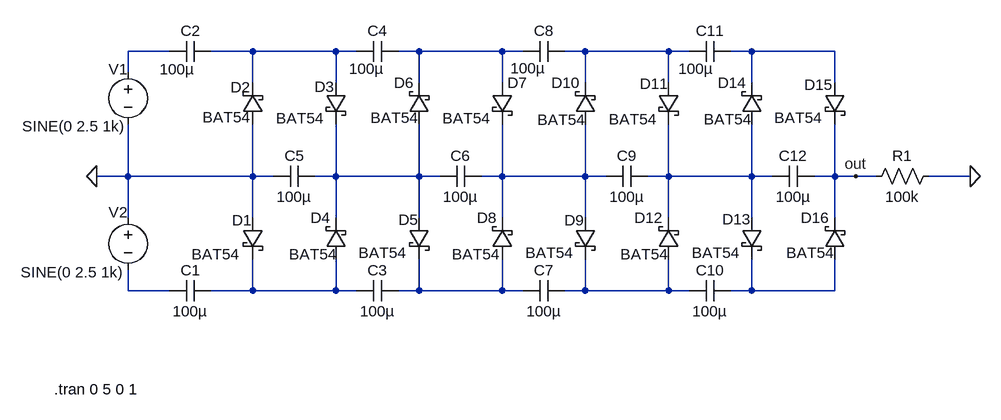
[diagram p0: schematic Draft1.asc]
Draft1.asc, the LTspice schematic file:
Version 4
SHEET 1 1124 680
WIRE -304 -608 -368 -608
WIRE -176 -608 -240 -608
WIRE -48 -608 -176 -608
WIRE -16 -608 -48 -608
WIRE 80 -608 48 -608
WIRE 208 -608 80 -608
WIRE 240 -608 208 -608
WIRE 336 -608 304 -608
WIRE 464 -608 336 -608
WIRE 496 -608 464 -608
WIRE 592 -608 560 -608
WIRE 720 -608 592 -608
WIRE -368 -576 -368 -608
WIRE -176 -560 -176 -608
WIRE -48 -560 -48 -608
WIRE 80 -560 80 -608
WIRE 208 -560 208 -608
WIRE 336 -560 336 -608
WIRE 464 -560 464 -608
WIRE 592 -560 592 -608
WIRE 720 -560 720 -608
WIRE -368 -416 -368 -496
WIRE -368 -416 -416 -416
WIRE -176 -416 -176 -496
WIRE -176 -416 -368 -416
WIRE -144 -416 -176 -416
WIRE -48 -416 -48 -496
WIRE -48 -416 -80 -416
WIRE 80 -416 80 -496
WIRE 80 -416 -48 -416
WIRE 112 -416 80 -416
WIRE 208 -416 208 -496
WIRE 208 -416 176 -416
WIRE 336 -416 336 -496
WIRE 336 -416 208 -416
WIRE 368 -416 336 -416
WIRE 464 -416 464 -496
WIRE 464 -416 432 -416
WIRE 592 -416 592 -496
WIRE 592 -416 464 -416
WIRE 624 -416 592 -416
WIRE 720 -416 720 -496
WIRE 720 -416 688 -416
WIRE 752 -416 720 -416
WIRE 784 -416 752 -416
WIRE 928 -416 864 -416
WIRE -368 -352 -368 -416
WIRE -176 -352 -176 -416
WIRE -48 -352 -48 -416
WIRE 80 -352 80 -416
WIRE 208 -352 208 -416
WIRE 336 -352 336 -416
WIRE 464 -352 464 -416
WIRE 592 -352 592 -416
WIRE 720 -352 720 -416
WIRE -368 -240 -368 -272
WIRE -304 -240 -368 -240
WIRE -176 -240 -176 -288
WIRE -176 -240 -240 -240
WIRE -48 -240 -48 -288
WIRE -48 -240 -176 -240
WIRE -16 -240 -48 -240
WIRE 80 -240 80 -288
WIRE 80 -240 48 -240
WIRE 208 -240 208 -288
WIRE 208 -240 80 -240
WIRE 240 -240 208 -240
WIRE 336 -240 336 -288
WIRE 336 -240 304 -240
WIRE 464 -240 464 -288
WIRE 464 -240 336 -240
WIRE 496 -240 464 -240
WIRE 592 -240 592 -288
WIRE 592 -240 560 -240
WIRE 720 -240 720 -288
WIRE 720 -240 592 -240
FLAG -416 -416 0
FLAG 752 -416 out
FLAG 928 -416 0
SYMBOL voltage -368 -592 R0
WINDOW 0 -15 -4 Top 2
WINDOW 3 -84 115 Bottom 2
WINDOW 123 0 0 Left 0
WINDOW 39 0 0 Left 0
SYMATTR InstName V1
SYMATTR Value SINE(0 2.5 1k)
SYMBOL voltage -368 -368 R0
WINDOW 0 -15 23 Bottom 2
WINDOW 3 -86 84 Top 2
WINDOW 123 0 0 Left 0
WINDOW 39 0 0 Left 0
SYMATTR InstName V2
SYMATTR Value SINE(0 2.5 1k)
SYMBOL cap -240 -256 R90
WINDOW 0 0 32 VBottom 2
WINDOW 3 32 32 VTop 2
SYMATTR InstName C1
SYMATTR Value 100µ
SYMBOL cap -240 -624 R90
WINDOW 0 0 32 VBottom 2
WINDOW 3 28 52 VTop 2
SYMATTR InstName C2
SYMATTR Value 100µ
SYMBOL schottky -192 -352 R0
WINDOW 3 -78 56 Left 2
WINDOW 0 -16 4 Left 2
SYMATTR Value BAT54
SYMATTR InstName D1
SYMATTR Description Diode
SYMATTR Type diode
SYMBOL schottky -160 -496 R180
WINDOW 0 19 57 Left 2
WINDOW 3 20 11 Left 2
SYMATTR InstName D2
SYMATTR Value BAT54
SYMATTR Description Diode
SYMATTR Type diode
SYMBOL schottky -64 -560 R0
WINDOW 3 -76 55 Left 2
WINDOW 0 -17 6 Left 2
SYMATTR Value BAT54
SYMATTR InstName D3
SYMATTR Description Diode
SYMATTR Type diode
SYMBOL schottky -32 -288 R180
WINDOW 0 24 64 Left 2
WINDOW 3 15 8 Left 2
SYMATTR InstName D4
SYMATTR Value BAT54
SYMATTR Description Diode
SYMATTR Type diode
SYMBOL cap -80 -432 R90
WINDOW 0 0 32 VBottom 2
WINDOW 3 32 32 VTop 2
SYMATTR InstName C5
SYMATTR Value 100µ
SYMBOL cap 48 -256 R90
WINDOW 0 0 32 VBottom 2
WINDOW 3 32 32 VTop 2
SYMATTR InstName C3
SYMATTR Value 100µ
SYMBOL cap 48 -624 R90
WINDOW 0 0 32 VBottom 2
WINDOW 3 27 49 VTop 2
SYMATTR InstName C4
SYMATTR Value 100µ
SYMBOL schottky 64 -352 R0
WINDOW 3 -77 54 Left 2
WINDOW 0 -16 3 Left 2
SYMATTR Value BAT54
SYMATTR InstName D5
SYMATTR Description Diode
SYMATTR Type diode
SYMBOL schottky 96 -496 R180
WINDOW 0 24 64 Left 2
WINDOW 3 17 10 Left 2
SYMATTR InstName D6
SYMATTR Value BAT54
SYMATTR Description Diode
SYMATTR Type diode
SYMBOL schottky 192 -560 R0
WINDOW 3 -76 55 Left 2
SYMATTR Value BAT54
SYMATTR InstName D7
SYMATTR Description Diode
SYMATTR Type diode
SYMBOL schottky 224 -288 R180
WINDOW 0 24 64 Left 2
WINDOW 3 20 8 Left 2
SYMATTR InstName D8
SYMATTR Value BAT54
SYMATTR Description Diode
SYMATTR Type diode
SYMBOL cap 176 -432 R90
WINDOW 0 0 32 VBottom 2
WINDOW 3 32 32 VTop 2
SYMATTR InstName C6
SYMATTR Value 100µ
SYMBOL cap 304 -256 R90
WINDOW 0 0 32 VBottom 2
WINDOW 3 32 32 VTop 2
SYMATTR InstName C7
SYMATTR Value 100µ
SYMBOL cap 304 -624 R90
WINDOW 0 0 32 VBottom 2
WINDOW 3 26 56 VTop 2
SYMATTR InstName C8
SYMATTR Value 100µ
SYMBOL schottky 320 -352 R0
WINDOW 3 -76 54 Left 2
WINDOW 0 -16 4 Left 2
SYMATTR Value BAT54
SYMATTR InstName D9
SYMATTR Description Diode
SYMATTR Type diode
SYMBOL schottky 352 -496 R180
WINDOW 0 24 64 Left 2
WINDOW 3 16 7 Left 2
SYMATTR InstName D10
SYMATTR Value BAT54
SYMATTR Description Diode
SYMATTR Type diode
SYMBOL schottky 448 -560 R0
WINDOW 3 -76 56 Left 2
WINDOW 0 -28 2 Left 2
SYMATTR Value BAT54
SYMATTR InstName D11
SYMATTR Description Diode
SYMATTR Type diode
SYMBOL schottky 480 -288 R180
WINDOW 0 24 64 Left 2
WINDOW 3 17 8 Left 2
SYMATTR InstName D12
SYMATTR Value BAT54
SYMATTR Description Diode
SYMATTR Type diode
SYMBOL cap 432 -432 R90
WINDOW 0 0 32 VBottom 2
WINDOW 3 32 32 VTop 2
SYMATTR InstName C9
SYMATTR Value 100µ
SYMBOL cap 560 -256 R90
WINDOW 0 0 32 VBottom 2
WINDOW 3 32 32 VTop 2
SYMATTR InstName C10
SYMATTR Value 100µ
SYMBOL cap 560 -624 R90
WINDOW 0 0 32 VBottom 2
WINDOW 3 27 54 VTop 2
SYMATTR InstName C11
SYMATTR Value 100µ
SYMBOL schottky 576 -352 R0
WINDOW 3 -76 54 Left 2
WINDOW 0 -29 2 Left 2
SYMATTR Value BAT54
SYMATTR InstName D13
SYMATTR Description Diode
SYMATTR Type diode
SYMBOL schottky 608 -496 R180
WINDOW 0 24 64 Left 2
WINDOW 3 16 8 Left 2
SYMATTR InstName D14
SYMATTR Value BAT54
SYMATTR Description Diode
SYMATTR Type diode
SYMBOL schottky 704 -560 R0
WINDOW 0 -31 3 Left 2
WINDOW 3 -77 54 Left 2
SYMATTR InstName D15
SYMATTR Value BAT54
SYMATTR Description Diode
SYMATTR Type diode
SYMBOL schottky 736 -288 R180
WINDOW 0 24 64 Left 2
WINDOW 3 17 10 Left 2
SYMATTR InstName D16
SYMATTR Value BAT54
SYMATTR Description Diode
SYMATTR Type diode
SYMBOL cap 688 -432 R90
WINDOW 0 0 32 VBottom 2
WINDOW 3 32 32 VTop 2
SYMATTR InstName C12
SYMATTR Value 100µ
SYMBOL res 768 -400 R270
WINDOW 0 32 56 VTop 2
WINDOW 3 0 56 VBottom 2
SYMATTR InstName R1
SYMATTR Value 100k
TEXT -352 -88 Right 2 !.tran 0 5 0 1

The netlist it stands for:
* Draft1.asc
V1 N001 0 SINE(0 2.5 1k)
V2 0 N009 SINE(0 2.5 1k)
C1 N010 N009 100µ
C2 N002 N001 100µ
D1 0 N010 BAT54
D2 0 N002 BAT54
D3 N002 N006 BAT54
D4 N010 N006 BAT54
C5 N006 0 100µ
C3 N011 N010 100µ
C4 N003 N002 100µ
D5 N006 N011 BAT54
D6 N006 N003 BAT54
D7 N003 N007 BAT54
D8 N011 N007 BAT54
C6 N007 N006 100µ
C7 N012 N011 100µ
C8 N004 N003 100µ
D9 N007 N012 BAT54
D10 N007 N004 BAT54
D11 N004 N008 BAT54
D12 N012 N008 BAT54
C9 N008 N007 100µ
C10 N013 N012 100µ
C11 N005 N004 100µ
D13 N008 N013 BAT54
D14 N008 N005 BAT54
D15 N005 out BAT54
D16 N013 out BAT54
C12 out N008 100µ
R1 out 0 100k
.model D D
.lib standard.dio
.tran 0 5 0 1
.backanno
.end